# EAGLE design OrbiMote v0.1 (EAGLE 6.6.0)
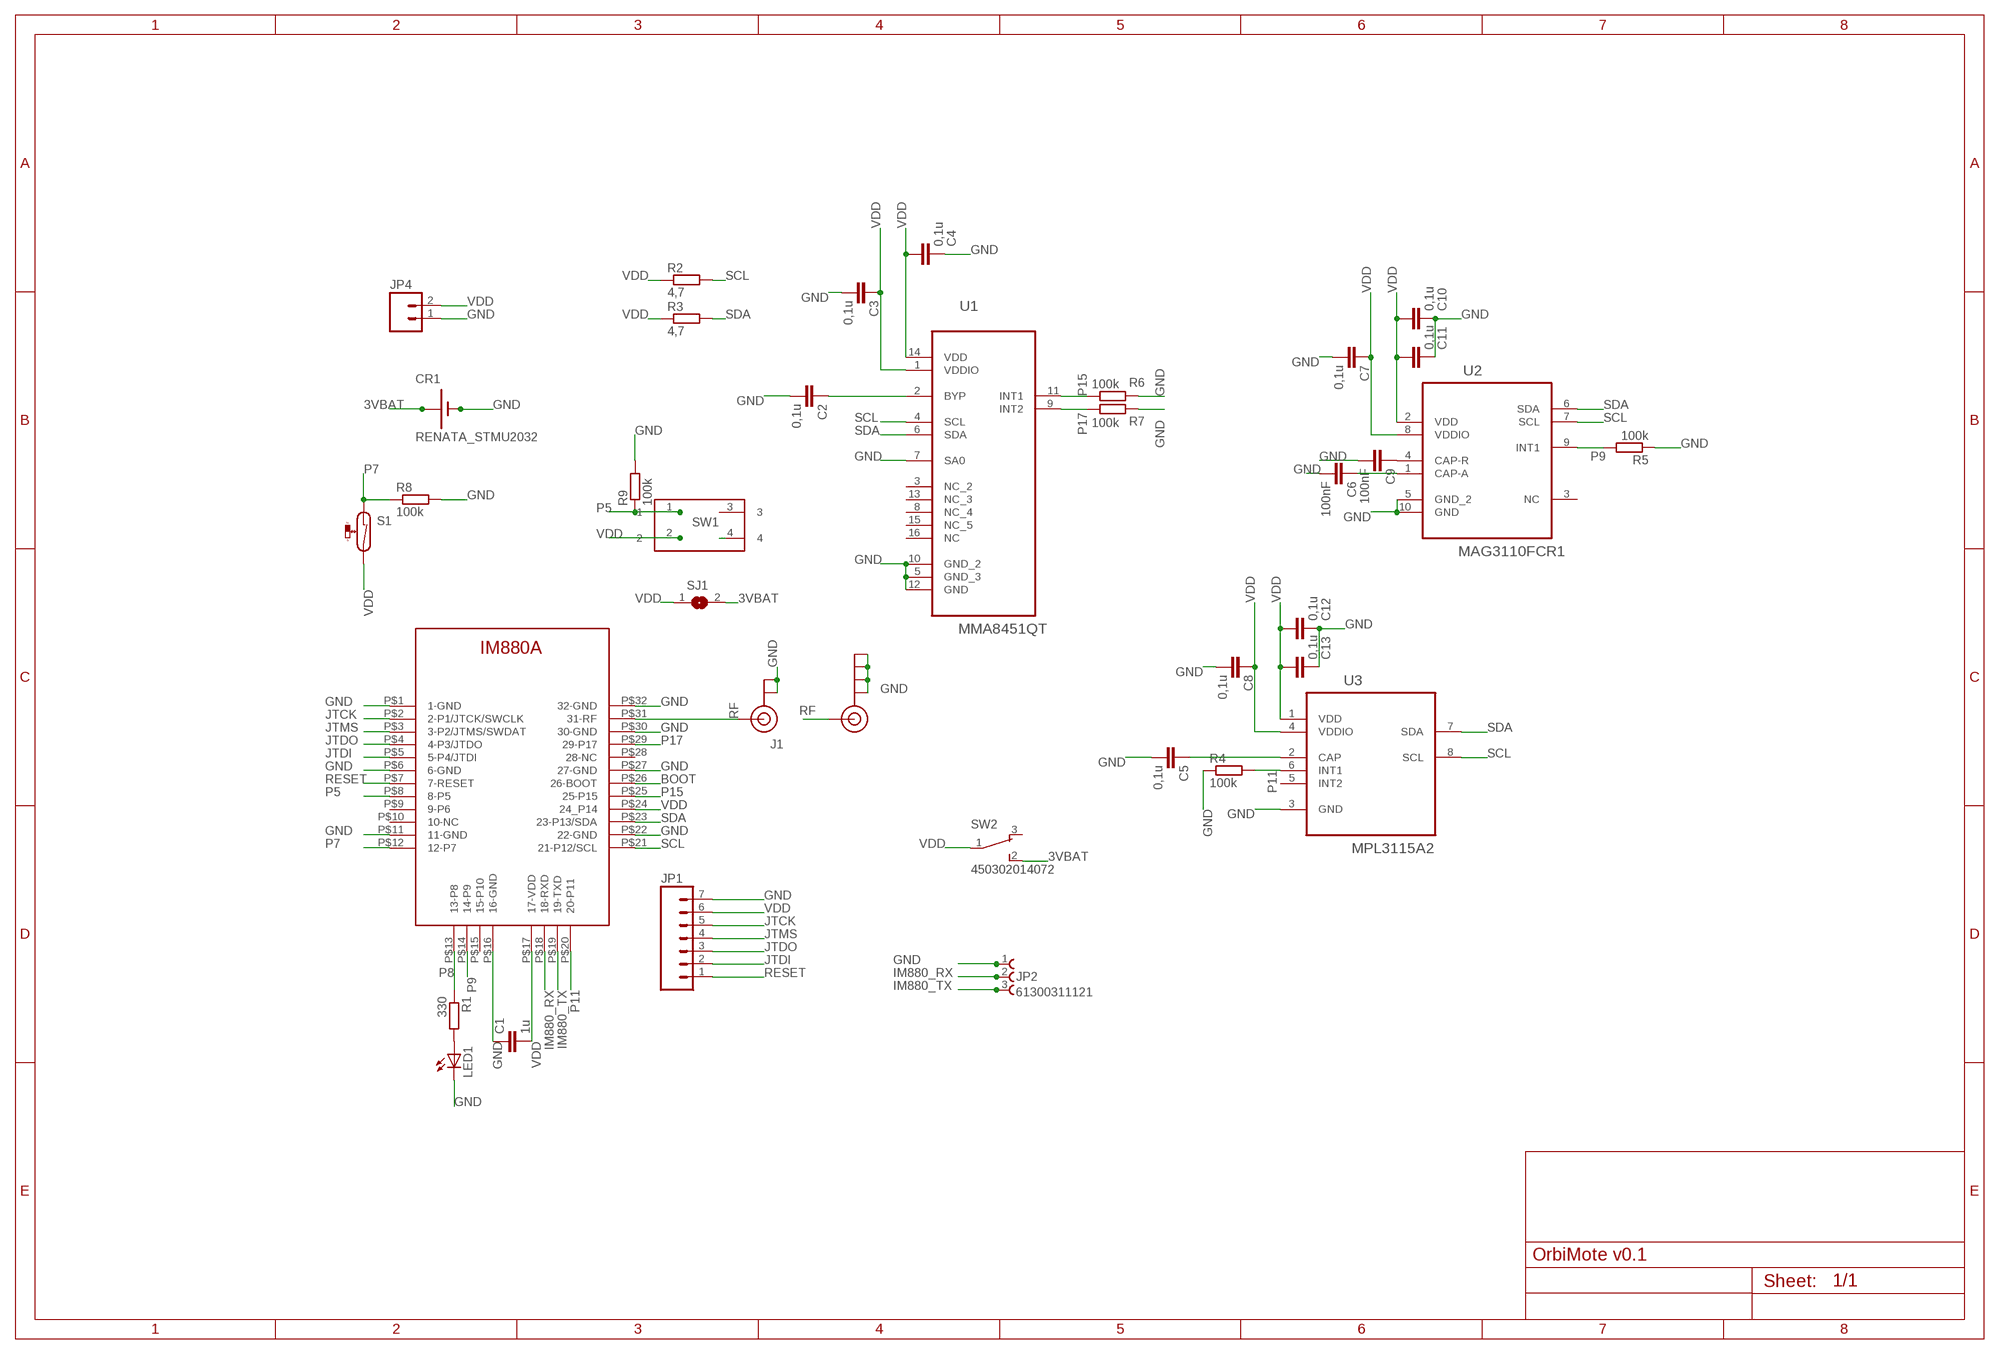
[diagram p0: schematic, sheet 1]

## Parts
C1  1u  C-EUC0603  [C0603]
C2  0,1u  C-EUC0603  [C0603]
C3  0,1u  C-EUC0603  [C0603]
C4  0,1u  C-EUC0603  [C0603]
C5  0,1u  C-EUC0603  [C0603]
C6  100nF  C-EUC0603  [C0603]
C7  0,1u  C-EUC0603  [C0603]
C8  0,1u  C-EUC0603  [C0603]
C9  100nF  C-EUC0603  [C0603]
C10  0,1u  C-EUC0603  [C0603]
C11  0,1u  C-EUC0603  [C0603]
C12  0,1u  C-EUC0603  [C0603]
C13  0,1u  C-EUC0603  [C0603]
CR1  RENATA_STMU2032  [SMTU2032]
IM1  IM880A  [IM880A]
J1  U.FL  [U.FL]
J$1  SMA_EDGE  [SMA-EDGE]
JP1  M07  [1X07]
JP2  61300311121  [61300311121]
JP4  M02JST-PTH-VERT  [JST-2-PTH-VERT]
LED1  LEDCHIPLED_0603  [CHIPLED_0603]
R1  330  R-EU_R0603  [R0603]
R2  4,7  R-EU_R0603  [R0603]
R3  4,7  R-EU_R0603  [R0603]
R4  100k  R-EU_R0603  [R0603]
R5  100k  R-EU_R0603  [R0603]
R6  100k  R-EU_R0603  [R0603]
R7  100k  R-EU_R0603  [R0603]
R8  100k  R-EU_R0603  [R0603]
R9  100k  R-EU_R0603  [R0603]
S1  REED-SWITCH-CT10-1530-G1  [CT10-G1]
SJ1  SJ  [SJ]
SW1  430152043826  [430152043826]
SW2  450302014072  [450302014072]
U1  MMA8451QT  [QFN50P300X300X100-16N]
U2  MAG3110FCR1  [DFN200X200X90-10N]
U3  MPL3115A2  [DFN300X500X120-8N]

## Nets
3VBAT: CR1.+(3VBAT) SJ1.2 SW2.2
BOOT: IM1.P$26(26-BOOT)
GND: C1.1 C2.2 C3.2 C4.2 C5.2 C6.2 C7.2 C8.2 C9.2 C10.2 C11.2 C12.2 C13.2 CR1.- IM1.P$1(1-GND) IM1.P$6(6-GND) IM1.P$11(11-GND) IM1.P$16(16-GND) IM1.P$22(22-GND) IM1.P$27(27-GND) IM1.P$30(30-GND) IM1.P$32(32-GND) J1.P$1(GND) J1.P$2(GND) J$1.GND@0(GND) J$1.GND@1(GND) J$1.GND@2(GND) J$1.GND@3(GND) JP1.7 JP2.1 JP4.1 LED1.C R4.1 R5.1 R6.1 R7.1 R8.2 R9.2 U1.5(GND_3) U1.7(SA0) U1.10(GND_2) U1.12(GND) U2.5(GND_2) U2.10(GND) U3.3(GND)
IM880_RX: IM1.P$18(18-RXD) JP2.2
IM880_TX: IM1.P$19(19-TXD) JP2.3
JTCK: IM1.P$2(2-P1/JTCK/SWCLK) JP1.5
JTDI: IM1.P$5(5-P4/JTDI) JP1.2
JTDO: IM1.P$4(4-P3/JTDO) JP1.3
JTMS: IM1.P$3(3-P2/JTMS/SWDAT) JP1.4
N$1: C2.1 U1.2(BYP)
N$2: C5.1 U3.2(CAP)
N$4: C9.1 U2.4(CAP-R)
N$5: C6.1 U2.1(CAP-A)
N$7: LED1.A R1.2
N$9: SW1.4
P5: IM1.P$8(8-P5) R9.1 SW1.1
P7: IM1.P$12(12-P7) R8.1 S1.1
P8: IM1.P$13(13-P8) R1.1
P9: IM1.P$14(14-P9) R5.2 U2.9(INT1)
P11: IM1.P$20(20-P11) R4.2 U3.6(INT1)
P15: IM1.P$25(25-P15) R6.2 U1.11(INT1)
P17: IM1.P$29(29-P17) R7.2 U1.9(INT2)
RESET: IM1.P$7(7-RESET) JP1.1
RF: IM1.P$31(31-RF) J1.P$3(SIGNAL) J$1.SIG(SIGNAL)
SCL: IM1.P$21(21-P12/SCL) R2.2 U1.4(SCL) U2.7(SCL) U3.8(SCL)
SDA: IM1.P$23(23-P13/SDA) R3.2 U1.6(SDA) U2.6(SDA) U3.7(SDA)
VDD: C1.2 C3.1 C4.1 C7.1 C8.1 C10.1 C11.1 C12.1 C13.1 IM1.P$17(17-VDD) IM1.P$24(24_P14) JP1.6 JP4.2 R2.1 R3.1 S1.2 SJ1.1 SW1.2 SW2.1 U1.1(VDDIO) U1.14(VDD) U2.2(VDD) U2.8(VDDIO) U3.1(VDD) U3.4(VDDIO)
Unconnected: IM1.P$9(9-P6) IM1.P$10(10-NC) IM1.P$15(15-P10) IM1.P$28(28-NC) SW1.3 SW2.3 U1.3(NC_2) U1.8(NC_4) U1.13(NC_3) U1.15(NC_5) U1.16(NC) U2.3(NC) U3.5(INT2)

## Library data of the parts
C1 = resistor:C-EU: CAPACITOR, European symbol
C2-C13 = rcl:C-EU: CAPACITOR, European symbol
CR1 = Ava:RENATA_STMU2032
IM1 = chip:IM880A
J1 = SparkFun-Connectors:U.FL: SMD antenna connector- WRL-09144; PROD_ID: CONN-09193
J$1 = SparkFun-Connectors:SMA_EDGE: SMA Antenna Connector End launch SMA connector. The paste layer has been removed so that the connector can be hand soldered onto the board after reflow.
JP1 = SparkFun-Connectors:M07: Header 7 Standard 7-pin 0.1" header. Use with straight break away headers (SKU : PRT-00116), right angle break away headers (PRT-00553), swiss pins (PRT-00743), machine pins (PRT-00117), and female headers (PRT-00115). NOTES ON THE VARIANTS LOCK and LOCK_LONGPADS... This footprint was designed to help hold the alignment of a through-hole component (i.e. 7-pin header) while soldering it into place. You may notice that each hole has been shifted either up or down by 0.005 of an inch from it's more standard position (which is usually a perfectly straight line). This slight alteration caused the pins (the squares in the middle) to touch the edges of the holes. Because they are alternating, it causes a "brace" to hold the header in place. 0.005 has proven to be the perfect amount of "off-center" position when using our standard breakaway headers. Although looks a little odd when you look at the bare footprint, once you have a header in there, the alteration is very hard to notice. Also, if you push a header all the way into place, it is covered up entirely on the bottom side. This idea of altering the position of holes to aid alignment will be further integrated into the Sparkfun Library for other footprints. It can help hold any component with 3 or more connection pins.
JP2 = Wuerth_Elektronik_eiCan_Board_to_Board_Connectors:61300311121: WR-PHD 5.54mm Pin Header, 3 Pin =>Code : Con_BTB_PHD_2.54_1_THT_61300311121 <http://katalog.we-online.de/media/images/eican/Con_BTB_PHD_2.54_1_THT_6130xx11121_pf2.jpg> Details see: http://katalog.we-online.de/en/em/613_0xx_111_21 Created 2014-05-29, Karrer Zheng 2014 (C) Würth Elektronik
JP4 = SparkFun-Connectors:M02: Standard 2-pin 0.1" header. Use with - straight break away headers ( PRT-00116) - right angle break away headers (PRT-00553) - swiss pins (PRT-00743) - machine pins (PRT-00117) - female headers (PRT-00115) Molex polarized connector foot print use with: PRT-08233 with associated crimp pins and housings. 2.54_SCREWTERM for use with PRT-10571. 3.5mm Screw Terminal footprints for PRT-08084 5mm Screw Terminal footprints for use with PRT-08432
LED1 = led:LED: LED OSRAM: - CHIPLED LG R971, LG N971, LY N971, LG Q971, LY Q971, LO R971, LY R971 LH N974, LH R974 LS Q976, LO Q976, LY Q976 LO Q996 - Hyper CHIPLED LW Q18S LB Q993, LB Q99A, LB R99A - SideLED LS A670, LO A670, LY A670, LG A670, LP A670 LB A673, LV A673, LT A673, LW A673 LH A674 LY A675 LS A676, LA A676, LO A676, LY A676, LW A676 LS A679, LY A679, LG A679 - Hyper Micro SIDELED® LS Y876, LA Y876, LO Y876, LY Y876 LT Y87S - SmartLED LW L88C, LW L88S LB L89C, LB L89S, LG L890 LS L89K, LO L89K, LY L89K LS L896, LA L896, LO L896, LY L896 - TOPLED LS T670, LO T670, LY T670, LG T670, LP T670 LSG T670, LSP T670, LSY T670, LOP T670, LYG T670 LG T671, LOG T671, LSG T671 LB T673, LV T673, LT T673, LW T673 LH T674 LS T676, LA T676, LO T676, LY T676, LB T676, LH T676, LSB T676, LW T676 LB T67C, LV T67C, LT T67C, LS T67K, LO T67K, LY T67K, LW E67C LS E67B, LA E67B, LO E67B, LY E67B, LB E67C, LV E67C, LT E67C LW T67C LS T679, LY T679, LG T679 LS T770, LO T770, LY T770, LG T770, LP T770 LB T773, LV T773, LT T773, LW T773 LH T774 LS E675, LA E675, LY E675, LS T675 LS T776, LA T776, LO T776, LY T776, LB T776 LHGB T686 LT T68C, LB T68C - Hyper Mini TOPLED® LB M676 - Mini TOPLED Santana® LG M470 LS M47K, LO M47K, LY M47K Source: http://www.osram.convergy.de LUXEON: - LUMILED® LXK2-PW12-R00, LXK2-PW12-S00, LXK2-PW14-U00, LXK2-PW14-V00 LXK2-PM12-R00, LXK2-PM12-S00, LXK2-PM14-U00 LXK2-PE12-Q00, LXK2-PE12-R00, LXK2-PE12-S00, LXK2-PE14-T00, LXK2-PE14-U00 LXK2-PB12-K00, LXK2-PB12-L00, LXK2-PB12-M00, LXK2-PB14-N00, LXK2-PB14-P00, LXK2-PB14-Q00 LXK2-PR12-L00, LXK2-PR12-M00, LXK2-PR14-Q00, LXK2-PR14-R00 LXK2-PD12-Q00, LXK2-PD12-R00, LXK2-PD12-S00 LXK2-PH12-R00, LXK2-PH12-S00 LXK2-PL12-P00, LXK2-PL12-Q00, LXK2-PL12-R00 Source: www.luxeon.com KINGBRIGHT: KA-3528ASYC Source: www.kingbright.com
R1-R9 = resistor:R-EU_: RESISTOR, European symbol
S1 = switch-reed:REED-SWITCH-: Reed Sensor; MF: COTO TECHNOLOGY; MPN: CT10-1530-G1; OC_FARNELL: 1081696
SJ1 = jumper:SJ: SMD solder JUMPER
SW1 = Kurzhubtaster:430152043826: WS-TSS-6x6 mm SMD Tact Switch,4 pins
SW2 = Kurzhubtaster:450302014072: WS-SUT, 10mm*2.5mm, SPDT, ON-ON, 2.54mm, right angle type, THT, Mini Slide Switch, 3 pins
U1 = chip:MMA8451QT: 14-bit/8-bit Digital Accelerometer,QFN-16; MPN: MMA8451QT; OC_FARNELL: 1842359; OC_NEWARK: 84R7351; PACKAGE: QFN-16; SUPPLIER: FREESCALE SEMICONDUCTOR
U2 = chip:MAG3110FCR1: MAGNETOMETER, 3AXIS, I2C, 80HZ,DFN-10; MPN: MAG3110FCR1; OC_FARNELL: 2080492; OC_NEWARK: 07W3591; PACKAGE: DFN-10; SUPPLIER: FREESCALE SEMICONDUCTOR
U3 = chip:MPL3115A2: PRESSURE SENSOR, 20-110KPA, 8LGA; MPN: MPL3115A2; OC_FARNELL: 2009084; OC_NEWARK: 48T4344; PACKAGE: 8LGA; SUPPLIER: FREESCALE SEMICONDUCTOR

## Board
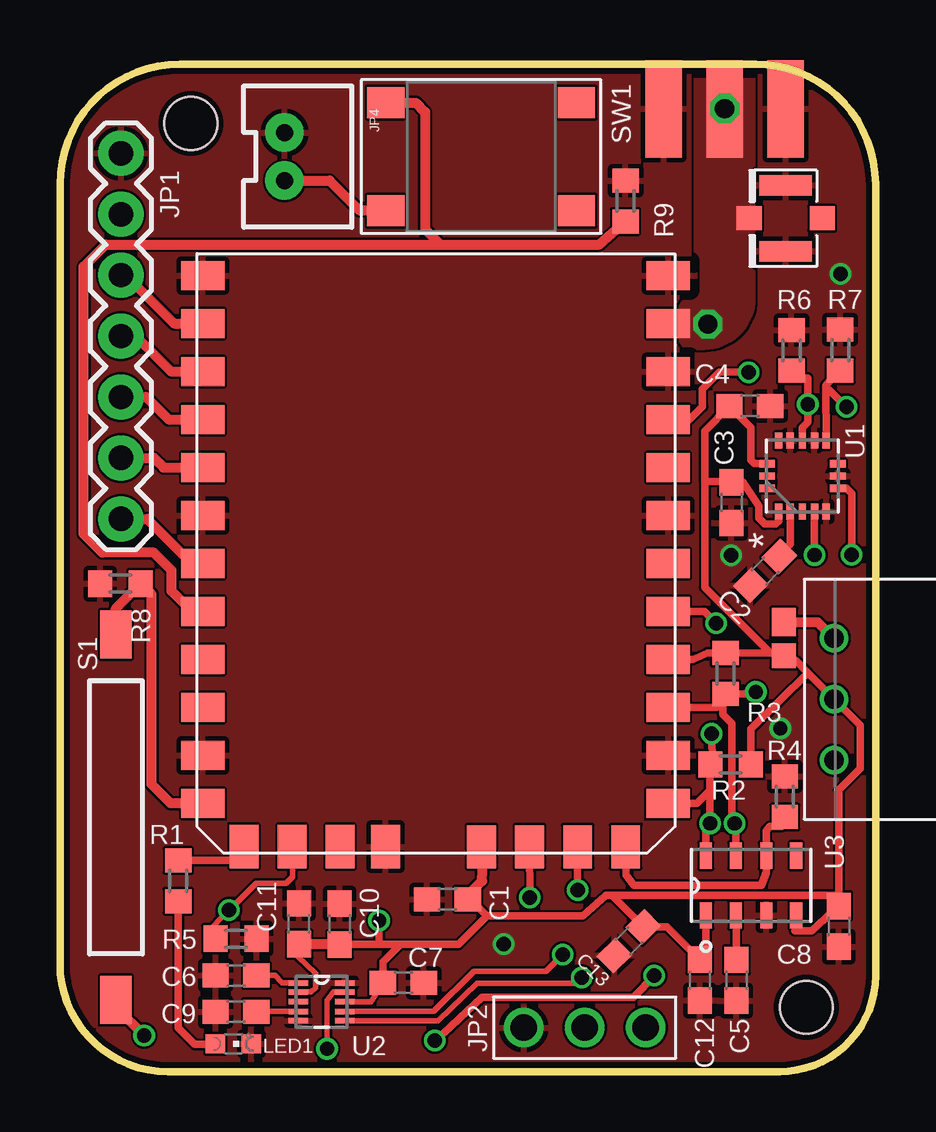
[diagram p1: board, top side]
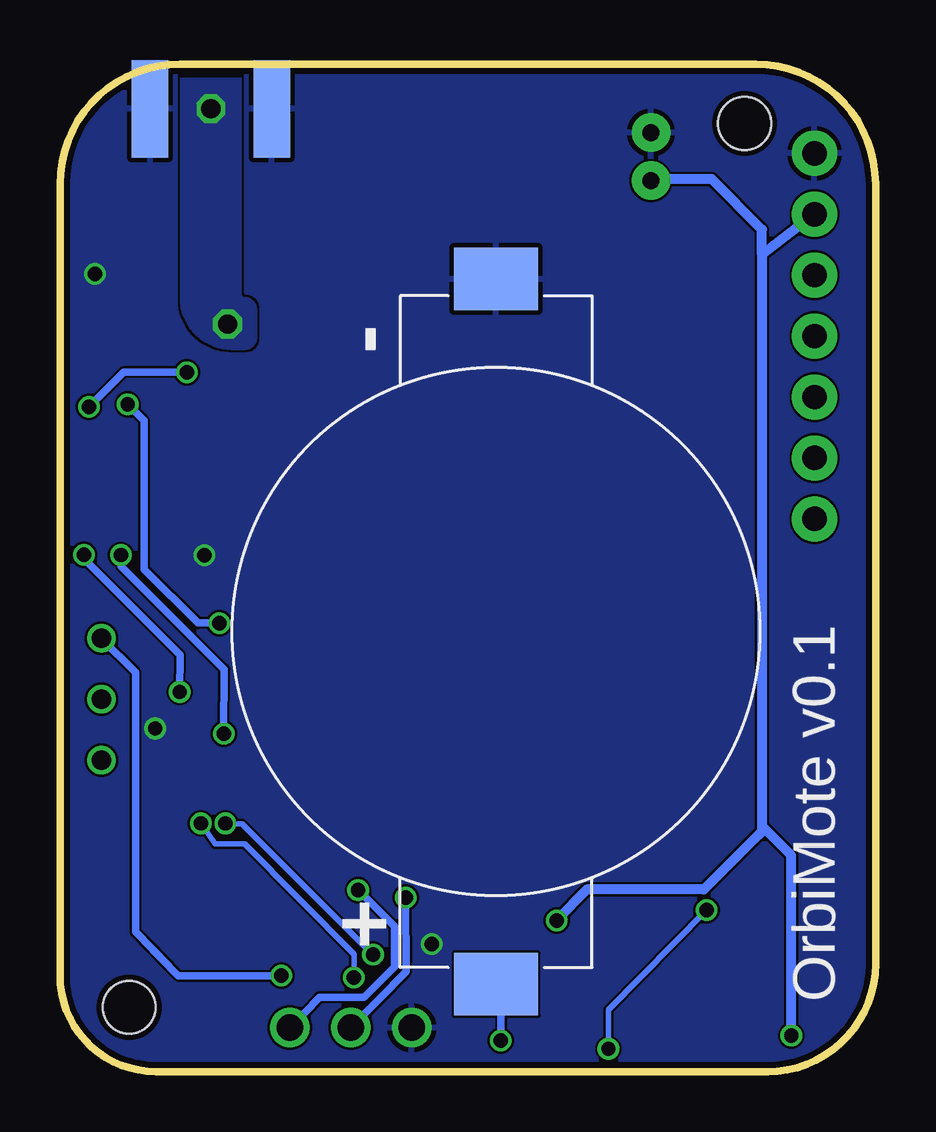
[diagram p2: board, bottom side, seen from below]

Size 34 x 42 mm. Coordinates in mm from the lower left corner, seen from the top.
Outline: 0,37 arc-90 5,42 29,42 arc-90 34,37 34,4 arc-90 30,0 4.5,0 arc-90 0,4.5 0,37
Copper layers (1*16): Top 0.035mm / dielectric 1.55mm / Bottom 0.035mm
Design rules "eC_2Layer_PClass6_BaseCopperO35 *": minimum track width 0.15mm, minimum drill 0.35mm, track to track 0.1mm, track to pad 0.1mm, pad to pad 0.1mm, via to via 0.1mm, smd to smd 0mil, copper to edge 0.25mm, drill to drill 0.35mm, minimum pad ring 0.175mm, minimum via ring 0.125mm, stop-mask expansion 0mil, vias tented up to drill 0.45mm, thermal gap 0.2mm
Holes 2.2 mm at 5.46,39.53 31.11,2.68

### Footprints (pad centres in the part's own frame; a part is rotated, then mirrored left to right if it is on the bottom)
C0603 = smd 1.1 x 1: 1 -0.85,0; 2 0.85,0
SMTU2032 = smd 2.6 x 3.5: + -14.7,0; - 14.7,0
IM880A = smd 1.8 x 1.2: P$1 0.343,-0.987; P$2 0.343,-2.987; P$3 0.343,-4.987; P$4 0.343,-6.987; P$5 0.343,-8.987; P$6 0.343,-10.987; P$7 0.343,-12.987; P$8 0.343,-14.987; P$9 0.343,-16.987; P$10 0.343,-18.987; P$11 0.343,-20.987; P$12 0.343,-22.987; P$21 19.743,-22.987; P$22 19.743,-20.987; P$23 19.743,-18.987; P$24 19.743,-16.987; P$25 19.743,-14.987; P$26 19.743,-12.987; P$27 19.743,-10.987; P$28 19.743,-8.987; P$29 19.743,-6.987; P$30 19.743,-4.987; P$31 19.743,-2.987; P$32 19.743,-0.987 | smd 1.2 x 1.8: P$13 2.063,-24.794; P$14 4.063,-24.794; P$15 6.063,-24.794; P$16 7.963,-24.794; P$17 11.963,-24.796; P$18 13.965,-24.796; P$19 15.969,-24.796; P$20 17.971,-24.797
U.FL = smd 2.2 x 0.85: P$1 0,1.375; P$2 0,-1.375 | smd 1.05 x 1: P$3 1.525,0; P$4 -1.525,0
SMA-EDGE = smd 1.524 x 4.064: GND@0 0,0; GND@1 5.08,0; SIG 2.54,0 | smd 1.524 x 4.064 bottom: GND@2 0,0; GND@3 5.08,0
1X07 = drill 1.016 pad 1.88: 1 0,0; 2 2.54,0; 3 5.08,0; 4 7.62,0; 5 10.16,0; 6 12.7,0; 7 15.24,0
61300311121 = drill 1.1: 1 -2.54,0; 2 0,0; 3 2.54,0
JST-2-PTH-VERT = drill 0.7 pad 1.6: 1 -1,-0.55; 2 1,-0.55
CHIPLED_0603 = smd 0.8 x 0.8: A 0,-0.75; C 0,0.75
R0603 = smd 1 x 1.1: 1 -0.85,0; 2 0.85,0
CT10-G1 = smd 2 x 1.3: 1 -7.62,0; 2 7.62,0
SJ = smd 1.016 x 1.016: 1 -0.762,0 | smd 1.168 x 1.016: 2 0.635,0
430152043826 = smd 1.55 x 1.3: 1 -3.975,2.25; 2 -3.975,-2.25; 3 3.975,2.25; 4 3.975,-2.25
450302014072 = drill 0.8: 1 0,0; 2 -2.54,0; 3 2.54,0
QFN50P300X300X100-16N = smd 0.66 x 0.305: 1 -1.473,0.991; 2 -1.473,0.508; 3 -1.473,0; 4 -1.473,-0.508; 5 -1.473,-0.991; 9 1.473,-0.991; 10 1.473,-0.508; 11 1.473,0; 12 1.473,0.508; 13 1.473,0.991 | smd 0.305 x 0.66: 6 -0.508,-1.473; 7 0,-1.473; 8 0.508,-1.473; 14 0.508,1.473; 15 0,1.473; 16 -0.508,1.473
DFN200X200X90-10N = smd 0.813 x 0.229: 1 -0.965,0.787; 2 -0.965,0.406; 3 -0.965,0; 4 -0.965,-0.406; 5 -0.965,-0.787; 6 0.965,-0.787; 7 0.965,-0.406; 8 0.965,0; 9 0.965,0.406; 10 0.965,0.787
DFN300X500X120-8N = smd 1.092 x 0.508: 1 -1.245,1.88; 2 -1.245,0.635; 3 -1.245,-0.635; 4 -1.245,-1.88; 5 1.245,-1.88; 6 1.245,-0.635; 7 1.245,0.635; 8 1.245,1.88

### Placement (x,y rotation side)
C1  16.15,7.19 0 top
C2  29.39,20.87 225 top
C3  27.99,23.72 270 top
C4  28.75,27.74 0 top
C5  28.2,3.81 270 top
C6  7.34,4.01 180 top
C7  14.31,3.71 0 top
C8  32.47,6.06 270 top
C9  7.34,2.5 180 top
C10  11.67,6.16 90 top
C11  9.97,6.17 90 top
C12  26.67,3.82 270 top
C13  23.72,5.44 225 top
CR1  15.82,18.35 90 bottom
IM1  5.61,34.17 0 top
J1  30.25,35.57 180 top
J$1  25.17,40.14 0 top
JP1  2.54,23.04 90 top
JP2  21.87,1.83 0 top
JP4  9.91,38.14 270 top
LED1  7.23,1.16 270 top
R1  4.93,7.95 270 top
R2  27.96,12.81 180 top
R3  27.75,16.6 270 top
R4  30.22,11.46 270 top
R5  7.34,5.54 180 top
R6  30.5,30.06 270 top
R7  32.53,30.08 270 top
R8  2.52,20.34 180 top
R9  23.58,36.29 90 top
S1  2.33,10.61 270 top
SJ1  30.18,18.11 90 top
SW1  17.56,38.14 0 top
SW2  32.27,15.52 270 top
U1  30.95,24.83 90 top
U2  10.91,2.91 0 top
U3  28.81,7.76 90 top

### Tracks (layer width: path | path; a pad name or v marks a point on that pad's centre or on a via)
3VBAT  (via drill 0.6)
  Top 0.305: v15.62,1.3 15.68,1.3 17.6,3.1 23.9,3.1 v24.77,4
  Top 0.406: SJ1.2 31.58,18.73 SW2.2
  Bottom 0.305: 17.32,3.35 15.62,3.35 v15.62,1.3 | SW2.2 30.85,16.64 30.85,5.83 29.49,4.42 30.48,5.46 29.07,4 v24.77,4
  Bottom 0.406: CR1.+ 17.27,3.27 17.32,3.35
GND  (via drill 0.6)
  other vias: 32.53,33.26 27.98,21.52 30.03,14.31 18.5,5.32
  pour Top (rank 2): -1.5,42.5 35,42.5 35,-1 -1.5,-1
  pour Bottom (rank 2): -0.96,42.96 35.54,42.96 35.54,-0.54 -0.96,-0.54
IM880_RX  (via drill 0.6)
  Top 0.305: IM1.P$18 v19.59,7.25
  Bottom 0.305: v19.59,7.25 19.57,4.17 JP2.2
IM880_TX  (via drill 0.6)
  Top 0.305: IM1.P$19 v21.58,7.58 v21.57,7.57
  Bottom 0.305: JP2.3 23.18,3.1 21.32,3.1 20.05,4.38 20.05,6.05 v21.57,7.57
JTCK
  Top 0.406: JP1.5 2.74,33.2 4.75,31.19 IM1.P$2
JTDI
  Top 0.406: JP1.2 3.92,25.58 4.32,25.18 IM1.P$5
JTDO
  Top 0.406: JP1.3 3.59,28.12 4.53,27.18 IM1.P$4
JTMS
  Top 0.406: JP1.4 3.16,30.66 4.63,29.18 IM1.P$3
N$1
  Top 0.305: C2.1 29.8,21.34 30.44,21.99 U1.2 30.43,23.34
N$2
  Top 0.305: C5.1 28.2,6.48 U3.2
N$4
  Top 0.23: U2.4 8.04,2.51 C9.1
N$5
  Top 0.23: C6.1 8.96,4.01 9.25,3.7 9.92,3.7 U2.1
N$7
  Top 0.305: R1.2 4.93,1.83 5.62,1.14 6.46,1.14 LED1.A
P5
  Top 0.406: IM1.P$8 5.5,19.18 4.65,20.04 4.65,20.9 3.92,21.63 1.77,21.63 0.98,22.42 0.98,33.56 1.9,34.48 15.86,34.48 | SW1.1 13.41,40.39 14.84,40.39 15.23,40 15.23,35.11 15.86,34.48 | 15.86,34.48 22.49,34.48 R9.1
P7
  Top 0.406: S1.1 2.33,19.31 R8.1 3.81,19.9 3.81,11.98 4.61,11.18 IM1.P$12
P8
  Top 0.305: R1.1 7.1,8.8 IM1.P$13
P9  (via drill 0.6)
  Top 0.23: R5.2 6.39,6.06 v7.04,6.74 6.99,6.66 8.18,7.85 9.42,7.85 9.7,8.13 9.7,9.35 IM1.P$14 | U2.9 11.4,3.32 11.13,2.97 v11.14,0.95
  Bottom 0.23: v11.14,0.95 11.13,2.57 v7.04,6.74
P11
  Top 0.23: 23.59,9.36 IM1.P$20 | 30.09,10.22 R4.2
  Top 0.305: 23.59,9.36 23.59,8.2 23.92,7.77 29.25,7.77 29.44,8.3 U3.6 29.44,10.07 29.59,10.22 30.09,10.22
P15  (via drill 0.6)
  Top 0.23: 31.18,28.92 R6.2
  Top 0.305: IM1.P$25 26.86,19.18 v27.35,18.7 | U1.11 30.94,26.84 31.18,27.08 v31.18,27.82 31.18,28.92
  Bottom 0.305: v27.35,18.7 28.25,18.7 30.49,20.94 30.49,27.14 v31.18,27.82
P17  (via drill 0.6)
  Top 0.23: 32.42,29.11 32.45,29.34 R7.2 | IM1.P$29 26.25,27.18 | v32.79,27.71
  Top 0.305: U1.9 31.94,28.57 | 31.94,28.57 31.94,28.64 32.42,29.11 | 26.25,27.18 26.78,27.72 26.78,28.45 27.49,29.15 v28.71,29.16 | v32.79,27.71 31.94,28.57
  Bottom 0.305: v28.71,29.16 31.35,29.16 v32.79,27.71
RESET
  Top 0.406: IM1.P$7 5.63,21.5 5.18,21.5 3.64,23.04 JP1.1
RF  (via drill 0.8)
  other vias: 27.71,40.14 27.01,31.16
  pour Top (hatched): 27.71,41.41 27.96,41.41 arc-90
  pour Top (isolate 0.406, no thermals): 26.31,32.14 arc90 26.57,32.39 26.57,41.54 28.85,41.54 28.85,32.27 arc-90 26.82,30.23 26.31,30.23 arc-90 25.93,30.61 25.93,31.76 arc-90
  pour Bottom (isolate 0.406, no thermals): 26.31,32.14 arc90 26.57,32.39 26.57,41.54 28.85,41.54 28.85,32.27 arc-90 26.82,30.23 26.31,30.23 arc-90 25.93,30.61 25.93,31.76 arc-90
SCL  (via drill 0.6)
  Top 0.23: U2.7 15.58,2.51 17.25,4.17 20.25,4.17 v20.95,4.88
  Top 0.305: IM1.P$21 25.36,11.18 26.56,11.18 27.1,11.71 | v27.18,14.08 27.19,12.81 R2.2 27.1,12.84 27.1,11.71 | 27.1,11.71 v27.1,10.35 26.93,10.18 U3.8 | U1.4 31.46,21.37 v31.46,21.54
  Bottom 0.23: v20.95,4.88 26.4,10.32 27.07,10.32 v27.1,10.35
  Bottom 0.305: v27.18,14.08 27.15,16.77 31.44,21.05 v31.46,21.54
SDA  (via drill 0.6)
  Top 0.23: U2.6 15.75,2.13 17.38,3.67 21.43,3.67 v21.75,3.92
  Top 0.305: IM1.P$23 27.39,15.18 R3.2 | R3.2 27.62,15.42 27.62,14.9 28,14.53 28,10.72 v28.12,10.35 28.17,10.2 U3.7 | R3.2 28.95,15.75 v29.01,15.83 | U1.6 32.78,24.32 33,24.1 v33,21.55
  Bottom 0.23: v21.75,3.92 21.75,4.9 26.3,9.5 27.52,9.5 v28.12,10.35
  Bottom 0.305: v29.01,15.83 29,17.38 32.98,21.35 v33,21.55
VDD  (via drill 0.6)
  Top 0.23: U2.8 12.97,2.91 C7.1 | U2.2 10.47,3.32 10.65,3.5 10.65,4.1 9.9,4.8 9.9,5.24 C11.1 | 22.77,7.35 23.01,7.35
  Top 0.305: 29.66,25.32 U1.14 29.46,25.35 28.95,25.35 28.8,25.5 28.8,26.85 C4.1 26.88,26.71 26.88,24.99 | 26.88,24.6 26.88,24.99 | U1.1 29.96,22.96 29.82,22.82 29.38,22.82 29.12,23.07 29.12,23.57 28.75,24.15 28.47,24.57 C3.1 28.11,24.59 26.88,24.6 | 29.62,17.45 R3.1 27,17.46 26.38,17.18 IM1.P$24 | 29.62,17.45 30.12,17.44 30.67,17.13 31.17,16.63 | 31.17,16.63 SW2.1 33.36,14.44 33.36,12.64 32.47,11.75 C8.1 | 26.73,4.75 C12.1 | C1.2 17.21,7.09 17.8,6.5 | U3.1 26.93,4.92 C12.1 | 17.8,6.5 21.79,6.5 22.77,7.35 32.45,7.35 32.5,7.19 32.47,7.13 C8.1 | 9.98,5.3 13.3,5.3 | 13.3,5.3 14.2,5.3 | C7.1 13.46,4.57 14.2,5.3 | C8.1 31.33,5.88 30.62,5.88 30.69,5.94 U3.4 | v13.3,6.3 13.3,5.3 | 14.2,5.3 16.61,5.3 17.8,6.5 | 26.88,24.6 | R2.1 28.81,14.28 31.17,16.63 | 23.01,7.35 C13.1 25.29,6.04 C12.1 | SJ1.1 29.92,17.34 | 26.88,24.99 26.88,24.96 26.88,20.19 29.62,17.45
  Top 0.406: C1.2 16.69,7.04 17.6,7.95 17.65,9.3 IM1.P$17 | C10.1 9.98,5.3 C11.1 | SJ1.1 30.35,17.36 30.12,17.44 | S1.2 2.33,2.68 v3.51,1.51 | SW1.2 12.5,35.89 11.25,37.14 JP4.2
  Bottom 0.406: 4.92,9.84 4.62,10.12 3.51,9.01 v3.51,1.51 | 4.92,9.84 7.17,7.6 12.04,7.6 v13.3,6.3 | 4.73,34.06 2.56,35.75 2.56,35.74 JP1.6 | 4.73,34.06 4.73,10.02 4.92,9.84 | 4.73,34.06 4.73,35.11 6.83,37.2 9.3,37.2 JP4.2

### Text on the board
bNames: OrbiMote v0.1